# Altium project MaverickPowerDistribution_v1.0.PrjPcb (part 1 of 2)
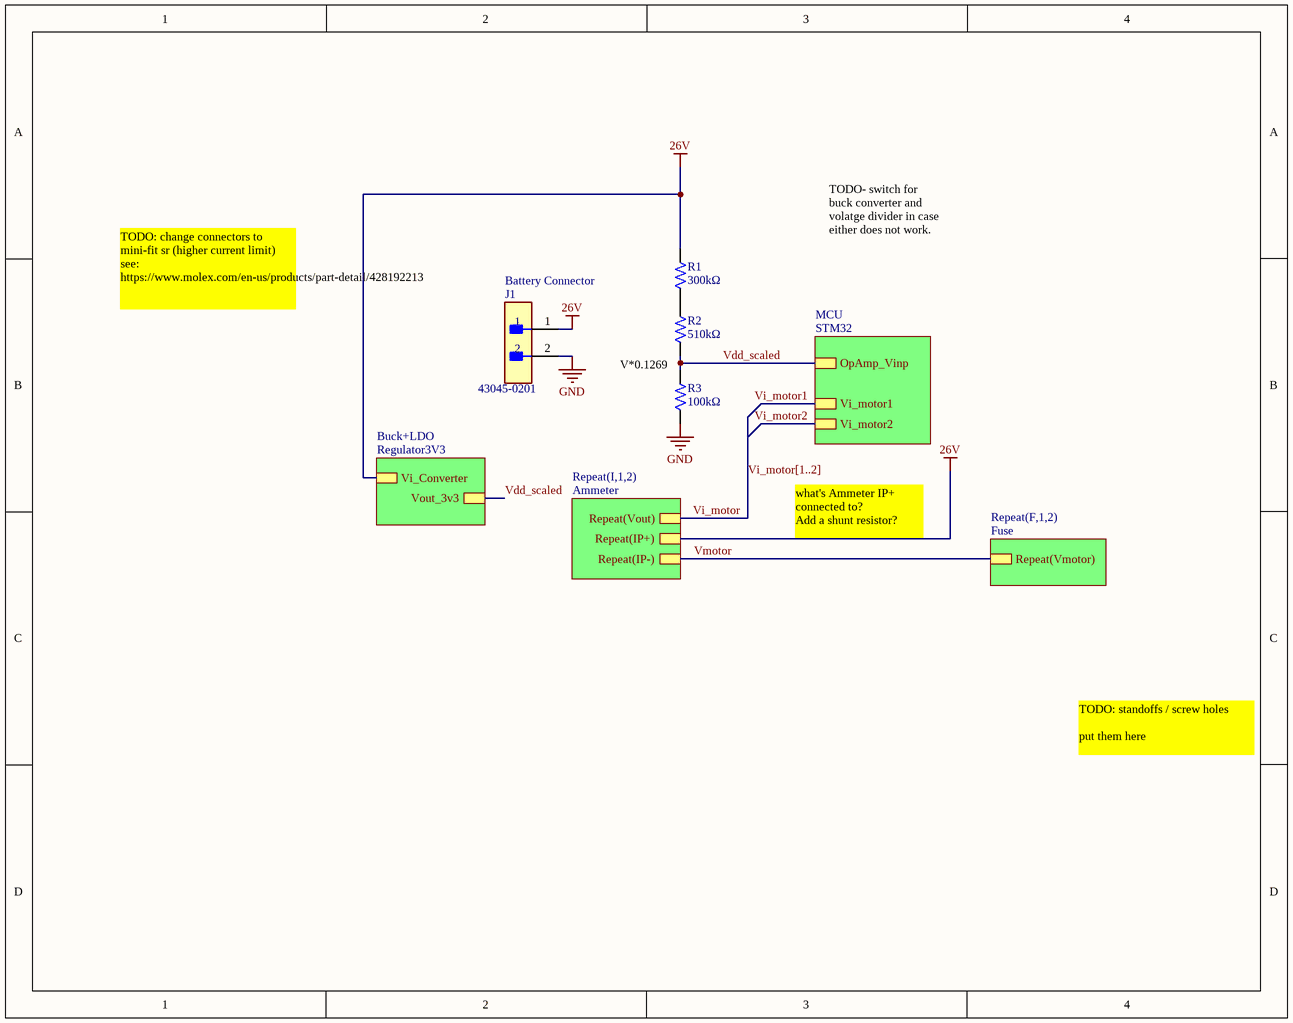
[diagram p0: Power.SchDoc]
8 sheets, 76 parts. Net scope: hierarchical (ports join the sheet entries above them; power ports are global).
Board file: PCB1.PcbDoc
Sheets:
  Power.SchDoc
    I1 = Ammeter.SchDoc
    I2 = Ammeter.SchDoc
    MCU = STM32.SchDoc
      128x64 OLED = Display.SchDoc
      Mass Storage = MicroSD.SchDoc
      Debugger = SWD.SchDoc
    F1 = Fuse.SchDoc
    F2 = Fuse.SchDoc
    Buck+LDO = Regulator3V3.SchDoc

## Sheet Power.SchDoc
size A; SheetNumber: 1; SheetTotal: 8

### Parts
J1  43045-0201  [FP-43045-0201-MFG]
R1  Resistance: 300kΩ  [RES-0603]  (hidden comment: 0603WAF3003T5E)
R2  Resistance: 510kΩ  [RES-0603]  (hidden comment: 0603WAF5103T5E)
R3  Resistance: 100kΩ  [RES-0402]  (hidden comment: 0402WGF1003TCE)

### Sub-sheets
Buck+LDO = Regulator3V3: Vi_Converter, Vout_3v3
MCU = STM32: Vi_motor1, Vi_motor2, OpAmp_Vinp
Repeat(F,1,2) = Fuse: Repeat(Vmotor)
Repeat(I,1,2) = Ammeter: Repeat(Vout), Repeat(IP-), Repeat(IP+)

### Nets
26V: J1.1 R1.2 ; sheet Repeat(I,1,2)/Repeat(IP+), sheet Buck+LDO/Vi_Converter
GND: J1.2 R3.1
Vdd_scaled: R2.1 R3.2 ; sheet MCU/OpAmp_Vinp, sheet Buck+LDO/Vout_3v3  [project net OPAMP1_VINP]
Vi_motor: sheet Repeat(I,1,2)/Repeat(Vout)
Vmotor: sheet Repeat(I,1,2)/Repeat(IP-), sheet Repeat(F,1,2)/Repeat(Vmotor)
NetR1_1: R1.1 R2.2

### Buses and harness runs
bus Vi_motor[1..2]

### Notes on the sheet
- (near J1) Battery Connector
- TODO- switch for buck converter and volatge divider in case either does not work.
- TODO: change connectors to mini-fit sr (higher current limit)
  see: https://www.molex.com/en-us/products/part-detail/428192213
- V*0.1269
- what's Ammeter IP+ connected to?
  Add a shunt resistor?
- TODO: standoffs / screw holes
  put them here

### Library data of the parts
J1 = CMP-04776-000998-1: CONN HEADER R/A 2POS; Number of Circuits: 2; Glow Wire Compliant: Compliant; Pitch: 3mm; Max Voltage Rating (DC): 250.25kV; Current Rating: 5A; Contact Resistance: 10mR; Gender: Male; Voltage Rating: 250V; Number of Positions: 2; Halogen Free: Low Halogen; Series: 43045; Mount: Through Hole; Packaging: Tray; Row Spacing: 3mm; Contact Material: Brass; Radiation Hardening: No; Number of Contacts: 2; Orientation: Right Angle; Max Operating Temperature: 105°C; Housing Material: Thermoplastic; Contact Plating: Gold; Case/Package: 0201; Number of Rows: 2; Min Operating Temperature: -40°C; Termination: Solder; Package Quantity: 3168
R1 = 0603WAF3003T5E: Resistor, 300kΩ, ±1%, 100mW, 75V, ±100ppm/℃, -55℃~+155℃, SMD 0603; Manufacturer: Uniroyal; Supplier 1: LCSC; Manufacturer Part Number: 0603WAF3003T5E; Supplier Part Number 1: C23024; JLCPCB Part Number: C23024; Power Rating: 100mW; Category: Resistors; Package Size: 0603; JLCPCB Basic Part: Yes; Tolerance: ±1%; Voltage Rating: 75V; Temperature Coefficient: ±100ppm/℃; Temperature Rating: -55℃~+155℃; ComponentLink1Description: Datasheet; ComponentLink1URL: https://wmsc.lcsc.com/wmsc/upload/file/pdf/v2/lcsc/2206010116_UNI-ROYAL-Uniroyal-Elec-0603WAF3003T5E_C23024.pdf; ComponentLink2Description: JLCPCB Part URL; ComponentLink2URL: https://jlcpcb.com/partdetail/C23024
R2 = 0603WAF5103T5E: Resistor, 510kΩ, ±1%, 100mW, 75V, ±100ppm/℃, -55℃~+155℃, SMD 0603; Manufacturer: Uniroyal; Supplier 1: LCSC; Manufacturer Part Number: 0603WAF5103T5E; Supplier Part Number 1: C23192; JLCPCB Part Number: C23192; Power Rating: 100mW; Category: Resistors; Package Size: 0603; JLCPCB Basic Part: Yes; Tolerance: ±1%; Voltage Rating: 75V; Temperature Coefficient: ±100ppm/℃; Temperature Rating: -55℃~+155℃; ComponentLink1Description: Datasheet; ComponentLink1URL: https://wmsc.lcsc.com/wmsc/upload/file/pdf/v2/lcsc/2206010116_UNI-ROYAL-Uniroyal-Elec-0603WAF5103T5E_C23192.pdf; ComponentLink2Description: JLCPCB Part URL; ComponentLink2URL: https://jlcpcb.com/partdetail/C23192
R3 = 0402WGF1003TCE: Resistor, 100kΩ, ±1%, 62.5mW, 50V, ±100ppm/℃, -55℃~+155℃, SMD 0402; Manufacturer: Uniroyal; Supplier 1: LCSC; Manufacturer Part Number: 0402WGF1003TCE; Supplier Part Number 1: C25741; JLCPCB Part Number: C25741; Power Rating: 62.5mW; Category: Resistors; Package Size: 0402; JLCPCB Basic Part: Yes; Tolerance: ±1%; Voltage Rating: 50V; Temperature Coefficient: ±100ppm/℃; Temperature Rating: -55℃~+155℃; ComponentLink1Description: Datasheet; ComponentLink1URL: https://wmsc.lcsc.com/wmsc/upload/file/pdf/v2/lcsc/2206010100_UNI-ROYAL-Uniroyal-Elec-0402WGF1003TCE_C25741.pdf; ComponentLink2Description: JLCPCB Part URL; ComponentLink2URL: https://jlcpcb.com/partdetail/C25741

## Sheet Ammeter.SchDoc
size A; SheetNumber: 7; SheetTotal: 8; SPICEModelCacheFFTHAXDY: <root> / <DocumentId>FFTHAXDY</DocumentId> / <CacheFrame Number="0"> / <Model Name="jmk105bj105_v-f" Kind="CKT"> / <Text>* JMK105BJ105_V-F     SPICE MODEL  ( General Type ) / *-------------------------------------------------------------------------------------------------------- / * Model Generated by TAIYO YUDEN Corporation (http://www.ty-top.com) / * Version 1.0 / * TAIYO YUDEN Control No. 170508_130520 / *-------------------------------------------------------------------------------------------------------- / * / * Products Name : Multilayer Ceramic Capacitors / * / * Characteristics : / *     Capacitance : 1 uF , Rated Voltage : 6.3V , TCC : X5R / *     Case Size : 1.0 x 0.5 / 0.039 x 0.02 [mm/inch] , Thickness : 0.5 / 0.02 [mm/inch] / *     (Conditions: Temperature = 25 degC , DC Bias Current/Voltage = 0A / 0V) / * / * Frequency Range : 40Hz - 3GHz / * / * External Node Assignments : / * / *  1  o---| |---o  2 / * / *-------------------------------------------------------------------------------------------------------- / .SubCkt JMK105BJ105_V-F 1 2 / **************************** / C0 1 110 0.63639u / Cm 1 101 0.20521u / C1 101 102 0.32947u / Rc1 101 102 4.3866k / C2 102 103 0.095518u / Rc2 102 103 147.03 / C3 103 110 0.027492u / Rc3 103 110 13.702 / C2m 1 301 0.26441u / C21 301 302 1.8886u / Rc21 301 302 5.8853k / C22 302 303 1.591u / Rc22 302 303 6.0107k / C23 303 304 1.1128u / Rc23 303 304 7.9202k / C24 304 305 0.6027u / Rc24 304 305 330.52 / C25 305 306 0.40375u / Rc25 305 306 352.84 / C26 306 307 0.52396u / Rc26 306 307 8.4799 / C27 307 308 0.86606u / Rc27 307 308 4.7644 / C28 308 309 0.52694u / Rc28 308 309 7.6737 / C29 309 110 1095.2p / Rc29 309 110 0.46166 / Rp0 1 110 100Meg / L0 110 120 0.22207n / Lm 120 130 0.1526n / L1 120 121 0.021807n / RL1 121 130 0.95652 / L2 120 122 0.17379n / RL2 122 130 0.69676 / L3 120 123 0.80256n / RL3 123 130 0.1611 / CR 120 124 0.086847u / LR 124 125 0.095213n / RR 125 130 0.14597 / CL 130 140 2.0214p / LL 130 140 0.14724n / RL 130 140 1.7247k / Rs 140 2 11.702m / **************************** / .ends</Text> / </Model> / </CacheFrame> / </root>
Used 2 times, as channels I1, I2. Parts and nets are listed once, with the designators drawn on the sheet.
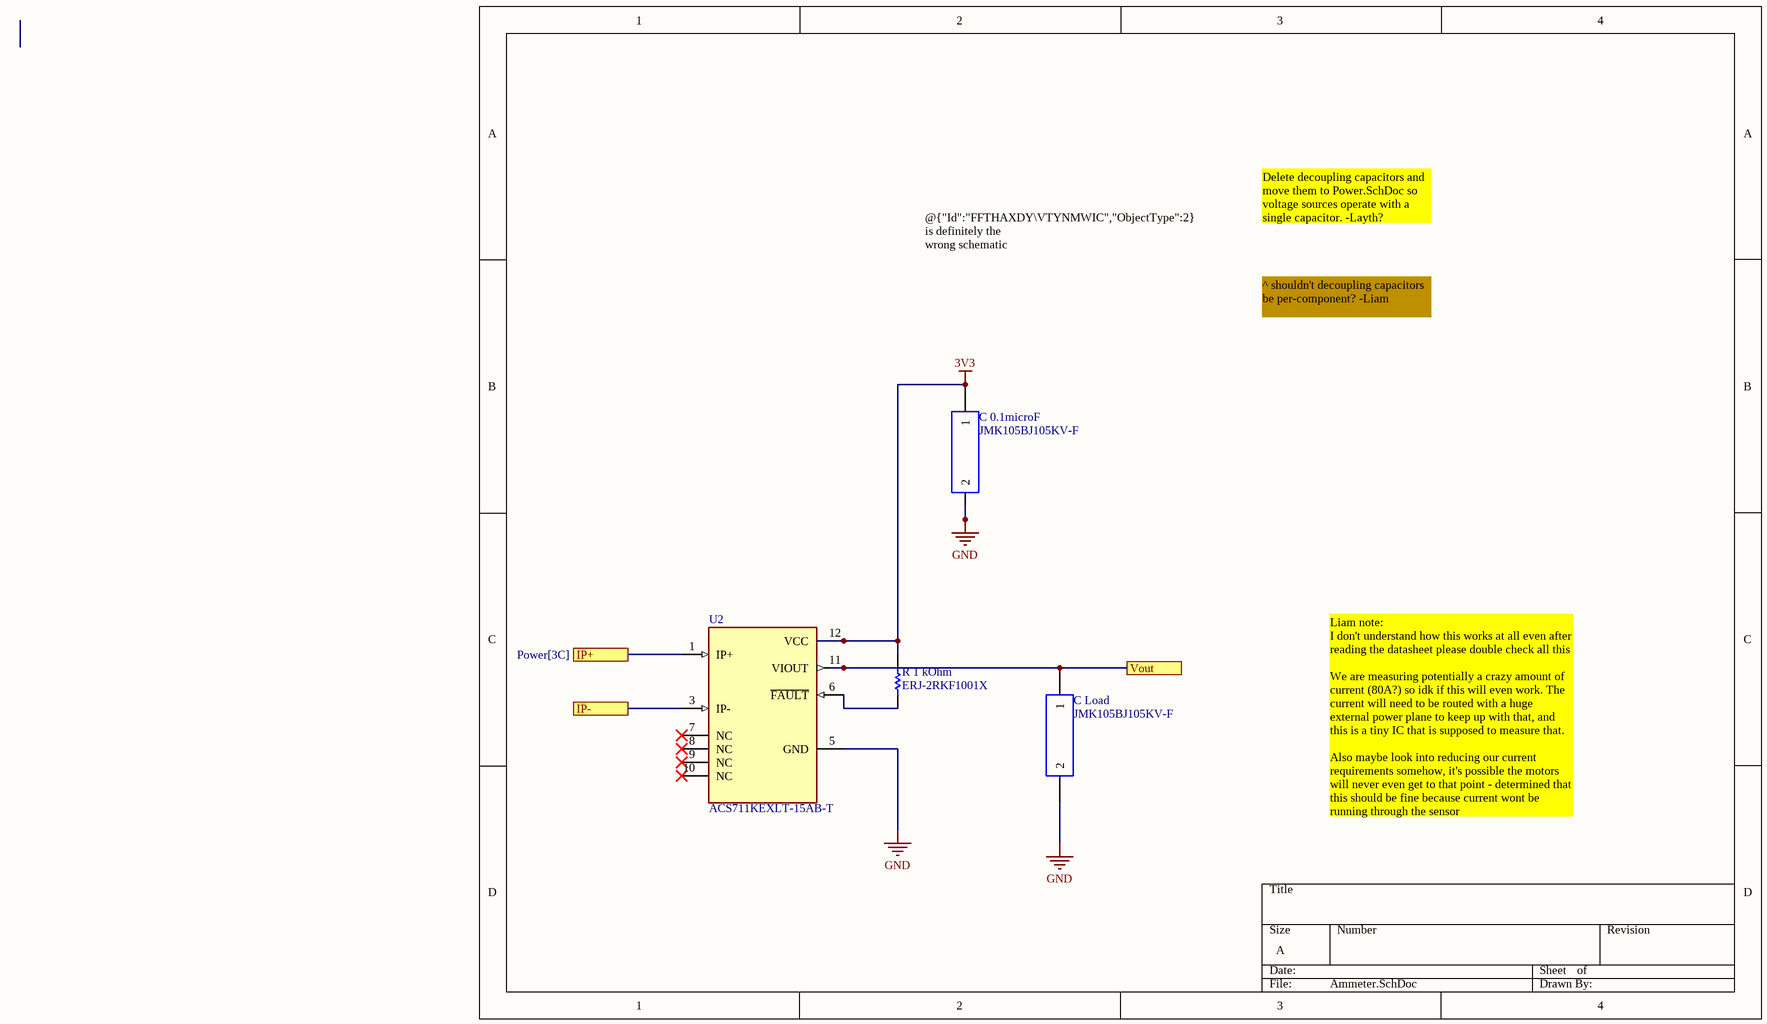
[diagram p1: Ammeter.SchDoc]

### Parts
C_0.1microF  JMK105BJ105KV-F
C_Load  JMK105BJ105KV-F
R_1_kOhm  ERJ-2RKF1001X  [RESC1005X40X25NL05T05]
U2  ACS711KEXLT-15AB-T  [XDCR_ACS711KEXLT-15AB-T]

### Ports
IP+ (see Power[3C]), IP- (see Power[3C]), Vout (see Power[3C])

### Nets
3V3: C_0.1microF.1 R_1_kOhm.2 U2.12(VCC)
GND: C_0.1microF.2 C_Load.2 U2.5(GND)
IP+: U2.1(IP+) ; port IP+
IP-: U2.3(IP-) ; port IP-
Vout: C_Load.1 U2.11(VIOUT) ; port Vout
NetR_1_kOhm_1: R_1_kOhm.1 U2.6(~{FAULT})

Not connected (* = marked no-connect by the designer): U2 7(NC)* 8(NC)* 9(NC)* 10(NC)*

### Channels
I1: designators C 0.1microF=C_0.1microFA C Load=C_LoadA R 1 kOhm=R_1_kOhmA U2=U2A; ports IP+=NetU2A_1 IP-=Vmotor1 Vout=ADC1_IN9
I2: designators C 0.1microF=C_0.1microFB C Load=C_LoadB R 1 kOhm=R_1_kOhmB U2=U2B; ports IP+=NetU2B_1 IP-=Vmotor2 Vout=ADC1_IN10

### Notes on the sheet
- Delete decoupling capacitors and move them to Power.SchDoc so voltage sources operate with a single capacitor. -Layth?
- @{"Id":"FFTHAXDY\VTYNMWIC","ObjectType":2} is definitely the wrong schematic
- ^ shouldn't decoupling capacitors be per-component? -Liam
- Liam note:
  I don't understand how this works at all even after reading the datasheet please double check all this
  We are measuring potentially a crazy amount of current (80A?) so idk if this will even work. The current will need to be routed with a huge external power plane to keep up with that, and this is a tiny IC that is supposed to measure that.
  Also maybe look into reducing our current requirements somehow, it's possible the motors will never even get to that point - determined that this should be fine because current wont be running through the sensor

### Library data of the parts
C_0.1microF C_Load = CMP-14477-004050-1: None; Voltage Rating: 6.3V; Dielectric: X5R; Capacitance: 1uF; Tolerance: 10%; Min Operating Temperature: -55°C; Construction: Flat; RoHS Compliant: Yes; Case Code (Imperial): 0402; Mount: Surface Mount; Number of Pins: 2; Termination: SMD/SMT; Series: M; Thickness: 0.022inch; Case Code (Metric): 1005; Packaging: Tape and Reel; Length: 1mm; Resistor Type: Ceramic; Package Quantity: 1; Max Operating Temperature: 85°C; Voltage Rating (DC): 6.3V; Case/Package: 0402; Width: 0.02inch; Lead Free: Lead Free; Radiation Hardening: No; Depth: 0.5mm; Halogen Free: Halogen Free; Height: 0.5mm; REACH SVHC: No SVHC
R_1_kOhm = CMP-1011-00510-4: Chip Resistor, 1 KOhm, +/- 1%, 100 mW, -55 to 155 degC, 0402 (1005 Metric), RoHS, Tape and Reel; Manufacturer: Basic Passives; Voltage Rating: 50 V; Case\/Package: 0402; Resistance: 1 KOhm; Power Rating: 100 mW; PartNumber: ERJ-2RKF1001X; DatasheetVersion: 04/2015; Radiation Hardening: No; Pins: 2; Height: 0.35 mm; RoHSCompliant: true; Case Code (Imperial): 0402; ComponentLink2Description: Datasheet; ComponentLink1Description: Manufacturer URL; PackageReference: 0402; Mount: Surface Mount; Package Quantity: 10000; Tolerance: 1%; ComponentLink1URL: http://www.panasonic.com/; PackageDescription: 2-Pin Surface Mount Device, Body 1 x 0.5 mm; Mounting Technology: Surface Mount; Case Code (Metric): 1005; ComponentLink2URL: http://industrial.panasonic.com/cdbs/www-data/pdf/RDA0000/AOA0000C86.pdf; REACH SVHC: Yes; Packaging: Tape and Reel; Max Operating Temperature: 155 degC; Min Operating Temperature: -55 degC; Width: 0.5 mm; Length: 1 mm
U2 = ACS711KEXLT-15AB-T: Current Sensor 31A 1 Channel Hall Effect, Open Loop Bidirectional 12-PowerWFQFN; MF: Allegro MicroSystems LLC; MP: ACS711KEXLT-31AB-T; Purchase-URL: https://pricing.snapeda.com/search/part/ACS711KEXLT-31AB-T/?ref=eda; Package: QFN-12 Allegro MicroSystems LLC; Value: *; Availability: In Stock; Price: None; SnapEDA_Link: https://www.snapeda.com/parts/ACS711KEXLT-31AB-T/Allegro+MicroSystems+LLC/view-part/?ref=snap; Check_prices: https://www.snapeda.com/parts/ACS711KEXLT-31AB-T/Allegro+MicroSystems+LLC/view-part/?ref=eda

## Sheet STM32.SchDoc
size A; SheetNumber: 3; SheetTotal: 8
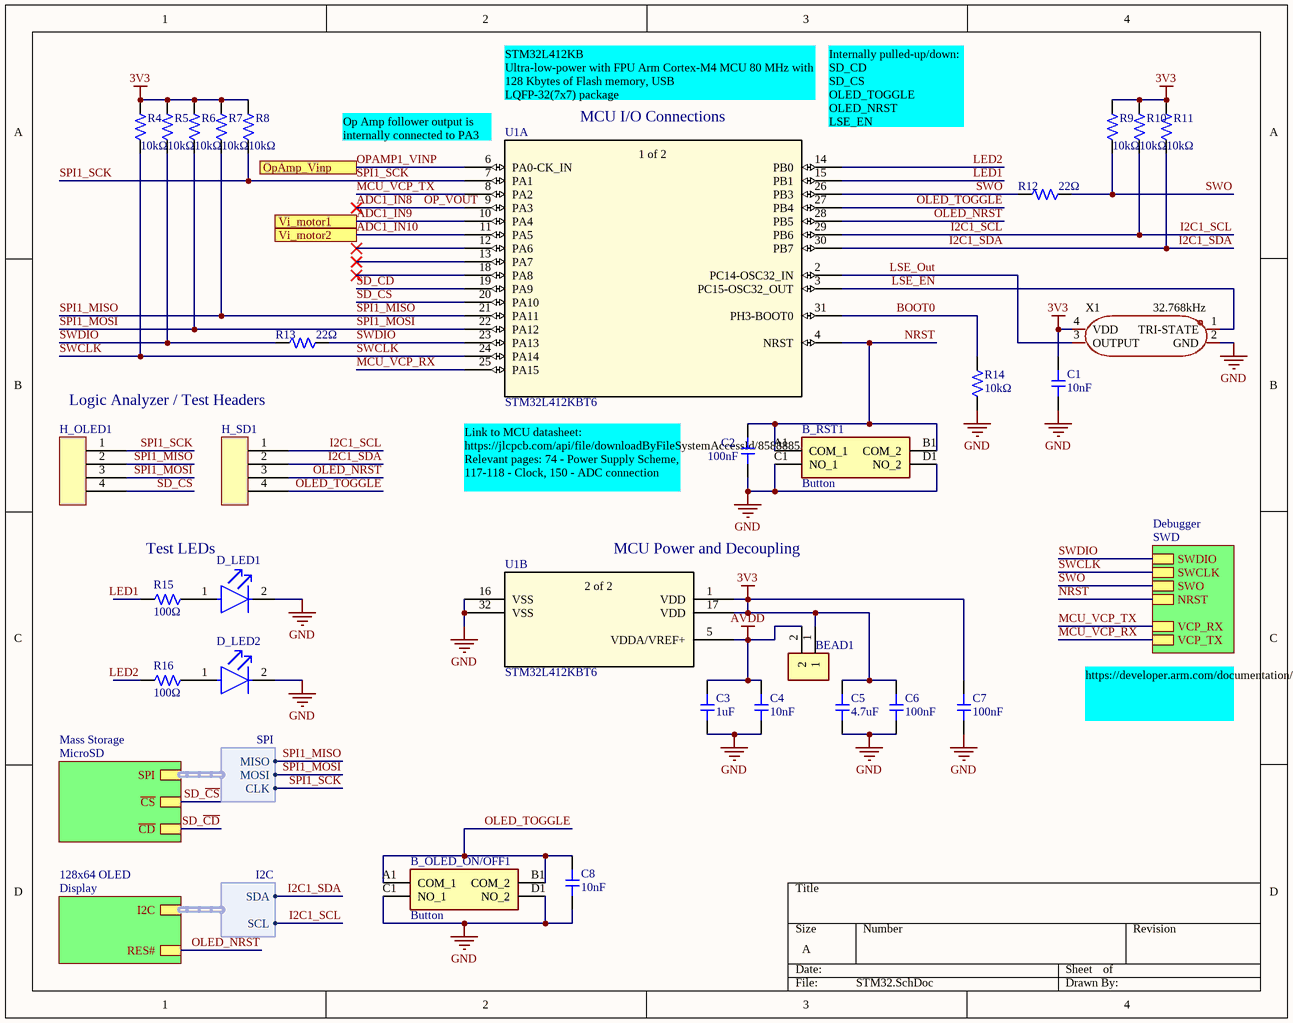
[diagram p2: STM32.SchDoc]

### Parts
B_OLED_ON/OFF1  Button  [TS1187ABAB]
B_RST1  Button  [TS1187ABAB]
BEAD1  GZ1608D601TF  [BEADC1608X95N]  (value not drawn)
C1  Capacitance: 10nF  [CAP-0402]  (hidden comment: CL05B103KB5NNNC)
C2  Capacitance: 100nF  [CAP-0402]  (hidden comment: CL05B104KB54PNC)
C3  Capacitance: 1uF  [CAP-0402]  (hidden comment: CL05A105KA5NQNC)
C4  Capacitance: 10nF  [CAP-0402]  (hidden comment: CL05B103KB5NNNC)
C5  Capacitance: 4.7uF  [CAP-0402]  (hidden comment: CL05A475MP5NRNC)
C6  Capacitance: 100nF  [CAP-0402]  (hidden comment: CL05B104KO5NNNC)
C7  Capacitance: 100nF  [CAP-0402]  (hidden comment: CL05B104KO5NNNC)
C8  Capacitance: 10nF  [CAP-0402]  (hidden comment: CL05B103KB5NNNC)
D_LED1  (no value)  [FP-AP2012EC-MFG]
D_LED2  (no value)  [FP-AP2012EC-MFG]
H_OLED1  4-pin Header  [4-pin Header]  (value not drawn)
H_SD1  4-pin Header  [4-pin Header]  (value not drawn)
R4  Resistance: 10kΩ  [RES-0402]  (hidden comment: 0402WGF1002TCE)
R5  Resistance: 10kΩ  [RES-0402]  (hidden comment: 0402WGF1002TCE)
R6  Resistance: 10kΩ  [RES-0402]  (hidden comment: 0402WGF1002TCE)
R7  Resistance: 10kΩ  [RES-0402]  (hidden comment: 0402WGF1002TCE)
R8  Resistance: 10kΩ  [RES-0402]  (hidden comment: 0402WGF1002TCE)
R9  Resistance: 10kΩ  [RES-0402]  (hidden comment: 0402WGF1002TCE)
R10  Resistance: 10kΩ  [RES-0402]  (hidden comment: 0402WGF1002TCE)
R11  Resistance: 10kΩ  [RES-0402]  (hidden comment: 0402WGF1002TCE)
R12  Resistance: 22Ω  [RES-0402]  (hidden comment: 0402WGF220JTCE)
R13  Resistance: 22Ω  [RES-0402]  (hidden comment: 0402WGF220JTCE)
R14  Resistance: 10kΩ  [RES-0402]  (hidden comment: 0402WGF1002TCE)
R15  Resistance: 100Ω  [RES-0402]  (hidden comment: 0402WGF1000TCE)
R16  Resistance: 100Ω  [RES-0402]  (hidden comment: 0402WGF1000TCE)
U1  STM32L412KBT6  [LQFP-32]  (parts A,B of 2)
X1  32.768kHz  [OSC-SMD_4P-L3.2-W2.5-BL]

### Sub-sheets
128x64 OLED = Display: I2C (harness I2C), RES#
Debugger = SWD: SWDIO, SWCLK, SWO, NRST, VCP_TX, VCP_RX
Mass Storage = MicroSD: SPI (harness SPI), ~{CS}, ~{CD}

### Ports
OpAmp_Vinp (see Power[3B]), Vi_motor1 (see Power[3B]), Vi_motor2 (see Power[3B])

### Harnesses
SPI: MISO, MOSI, CLK
I2C: SDA, SCL

### Nets
3V3: BEAD1.1 C1.2 C5.2 C6.2 C7.2 R4.2 R5.2 R6.2 R7.2 R8.2 R9.2 R10.2 R11.2 U1.1(VDD) U1.17(VDD) X1.4(VDD)
AVDD: BEAD1.2 C3.2 C4.2 U1.5(VDDA/VREF+)
GND: B_OLED_ON/OFF1.C1(NO_1) B_OLED_ON/OFF1.D1(NO_2) B_RST1.C1(NO_1) B_RST1.D1(NO_2) C1.1 C2.1 C3.1 C4.1 C5.1 C6.1 C7.1 C8.1 D_LED1.2(C) D_LED2.2(C) R14.1 U1.16(VSS) U1.32(VSS) X1.2(GND)
ADC1_IN8: U1.9(PA3)  [also labelled OP_VOUT]
ADC1_IN9: U1.10(PA4) ; port Vi_motor1
ADC1_IN10: U1.11(PA5) ; port Vi_motor2
BOOT0: R14.2 U1.31(PH3-BOOT0)
I2C1_SCL: H_SD1.1 R10.1 U1.29(PB6) ; sheet 128x64 OLED/I2C.SCL  [project net I2C.SCL]
I2C1_SDA: H_SD1.2 R11.1 U1.30(PB7) ; sheet 128x64 OLED/I2C.SDA  [project net I2C.SDA]
LED1: R15.1 U1.15(PB1)
LED2: R16.1 U1.14(PB0)
LSE_EN: U1.3(PC15-OSC32_OUT) X1.1(TRI-STATE)
LSE_Out: U1.2(PC14-OSC32_IN) X1.3(OUTPUT)
MCU_VCP_RX: U1.25(PA15) ; sheet Debugger/VCP_TX
MCU_VCP_TX: U1.8(PA2) ; sheet Debugger/VCP_RX
NRST: B_RST1.A1(COM_1) B_RST1.B1(COM_2) C2.2 U1.4(NRST) ; sheet Debugger/NRST
OLED_NRST: H_SD1.3 U1.28(PB5) ; sheet 128x64 OLED/RES#
OLED_TOGGLE: B_OLED_ON/OFF1.A1(COM_1) B_OLED_ON/OFF1.B1(COM_2) C8.2 H_SD1.4 U1.27(PB4)
OPAMP1_VINP: U1.6(PA0-CK_IN) ; port OpAmp_Vinp
SD_~{CD}: U1.19(PA9) ; sheet Mass Storage/~{CD}  [project net CardDetect]
SD_~{CS}: H_OLED1.4 U1.20(PA10) ; sheet Mass Storage/~{CS}  [project net ~{CS}]
SPI1_MISO: H_OLED1.2 R7.1 U1.21(PA11) ; sheet Mass Storage/SPI.MISO  [project net SPI.MISO]
SPI1_MOSI: H_OLED1.3 R6.1 U1.22(PA12) ; sheet Mass Storage/SPI.MOSI  [project net SPI.MOSI]
SPI1_SCK: H_OLED1.1 R8.1 U1.7(PA1) ; sheet Mass Storage/SPI.CLK  [project net SPI.CLK]
SWCLK: R4.1 U1.24(PA14) ; sheet Debugger/SWCLK
SWDIO: R5.1 R13.1 R13.2 U1.23(PA13) ; sheet Debugger/SWDIO
SWO: R9.1 R12.1 R12.2 U1.26(PB3) ; sheet Debugger/SWO
NetD_LED1_1: D_LED1.1(A) R15.2
NetD_LED2_1: D_LED2.1(A) R16.2

Not connected (* = marked no-connect by the designer): U1 12(PA6)* 13(PA7)* 18(PA8)*

### Notes on the sheet
- STM32L412KB
  Ultra-low-power with FPU Arm Cortex-M4 MCU 80 MHz with 128 Kbytes of Flash memory, USB
  LQFP-32(7x7) package
- (near U1) Op Amp follower output is internally connected to PA3
- (near U1) MCU I/O Connections
- (near U1) Internally pulled-up/down:
  SD_CD
  SD_CS
  OLED_TOGGLE
  OLED_NRST
  LSE_EN
- Logic Analyzer / Test Headers
- Link to MCU datasheet: https://jlcpcb.com/api/file/downloadByFileSystemAccessId/8588885545674424320
  Relevant pages: 74 - Power Supply Scheme, 117-118 - Clock, 150 - ADC connection
- Test LEDs
- (near U1) MCU Power and Decoupling
- https://developer.arm.com/documentation/dui0499/a/Target-Interface-Connections/SWD-connections
- (in symbol STM32L412KBT6, part A) 1 of 2
- (in symbol STM32L412KBT6, part B) 2 of 2

### Library data of the parts
B_OLED_ON/OFF1 B_RST1 = TS-1187A-B-A-B: Manufacturer_Name: XKB Connectivity; Datasheet Link: http://www.helloxkb.com/public/images/pdf/TS-1187A-X-X-X.pdf; Height: 4.05mm; Manufacturer_Part_Number: TS-1187A-B-A-B
BEAD1 = GZ1608D601TF: Ferrite Bead; Manufacturer_Name: SUNLORD; Datasheet Link: https://datasheet.lcsc.com/szlcsc/Sunlord-GZ1608D601TF_C1002.pdf; Height: 0.95mm; Manufacturer_Part_Number: GZ1608D601TF
C1 C4 C8 = CL05B103KB5NNNC: Capacitor, Ceramic (MLCC), 10nF, ±10%, 50V, X7R, ±10%, SMD 0402; Manufacturer: Samsung Electro-Mechanics; Temperature Rating: -55°C ~ 125°C; Capacitance @ 1V DC Bias: 10.426nF; Capacitance @ 1.2V DC Bias: 10.434nF; Capacitance @ 1.35V DC Bias: 10.444nF; Capacitance @ 1.5V DC Bias: 10.455nF; Capacitance @ 1.8V DC Bias: 10.480nF; Capacitance @ 2.5V DC Bias: 10.514nF; Capacitance @ 3.3V DC Bias: 10.519nF; Capacitance @ 3.7V DC Bias: 10.504nF; Capacitance @ 4.2V DC Bias: 10.473nF; Capacitance @ 5V DC Bias: 10.402nF; Capacitance @ 9V DC Bias: 10.052nF; Capacitance @ 12V DC Bias: 9.639nF; Capacitance @ 15V DC Bias: 9.187nF; Capacitance @ 24V DC Bias: 7.606nF; Capacitance @ 36V DC Bias: 5.499nF; Capacitance @ 48V DC Bias: 3.591nF; Impedance (0V Bias) @ 100Hz: 1.57E+05Ω; Impedance (0V Bias) @ 500Hz: 3.19E+04Ω; Impedance (0V Bias) @ 1kHz: 1.61E+04Ω; Impedance (0V Bias) @ 5kHz: 3.27E+03Ω; Impedance (0V Bias) @ 10kHz: 1.65E+03Ω; Impedance (0V Bias) @ 50kHz: 335Ω; Impedance (0V Bias) @ 100kHz: 169Ω; Impedance (0V Bias) @ 500kHz: 34.3Ω; Impedance (0V Bias) @ 1MHz: 17.3Ω; Impedance (0V Bias) @ 5MHz: 3.52Ω; Impedance (0V Bias) @ 10MHz: 1.77Ω; Impedance (0V Bias) @ 50MHz: 0.285Ω; Impedance (0V Bias) @ 100MHz: 0.0835Ω; Impedance (0V Bias) @ 500MHz: 0.751Ω; Impedance (0V Bias) @ 1GHz: 1.42Ω; Impedance (0V Bias) @ 2GHz: 3.22Ω; Impedance (0V Bias) @ 5GHz: 6.48Ω; Package Size: 0402; JLCPCB Basic Part: Yes; JLCPCB Part Number: C15195; Supplier 1: LCSC; Category: Capacitors - MLCC; Supplier Part Number 1: C15195; Manufacturer Part Number: CL05B103KB5NNNC; Tolerance: ±10%; Voltage Rating: 50V; Temperature Coefficient: X7R; RoHS: Yes; ComponentLink1Description: Datasheet; ComponentLink1URL: https://wmsc.lcsc.com/wmsc/upload/file/pdf/v2/lcsc/2304140030_Samsung-Electro-Mechanics-CL05B103KB5NNNC_C15195.pdf; ComponentLink2Description: JLCPCB Part URL; ComponentLink2URL: https://jlcpcb.com/partdetail/C15195; ComponentLink3Description: LCSC Part URL; ComponentLink3URL: https://lcsc.com/product-detail/Multilayer-Ceramic-Capacitors-MLCC---SMD-SMT_Samsung-Electro-Mechanics-Samsung-Electro-Mechanics-CL05B103KB5NNNC_C15195.html; ComponentLink4Description: Samsung Component Library; ComponentLink4URL: https://weblib.samsungsem.com/mlcc/mlcc-ec.do?partNumber=CL05B103KB5NNN
C2 = CL05B104KB54PNC: Capacitor, Ceramic (MLCC), 100nF, ±10%, 50V, X7R, ±10%, SMD 0402; Manufacturer: Samsung Electro-Mechanics; Temperature Rating: -55°C ~ 125°C; Capacitance @ 1V DC Bias: 105.687nF; Capacitance @ 1.2V DC Bias: 105.639nF; Capacitance @ 1.35V DC Bias: 105.594nF; Capacitance @ 1.5V DC Bias: 105.528nF; Capacitance @ 1.8V DC Bias: 105.317nF; Capacitance @ 2.5V DC Bias: 104.216nF; Capacitance @ 3.3V DC Bias: 102.385nF; Capacitance @ 3.7V DC Bias: 101.236nF; Capacitance @ 4.2V DC Bias: 99.650nF; Capacitance @ 5V DC Bias: 96.918nF; Capacitance @ 9V DC Bias: 81.073nF; Capacitance @ 12V DC Bias: 69.786nF; Capacitance @ 15V DC Bias: 59.475nF; Capacitance @ 24V DC Bias: 38.112nF; Capacitance @ 36V DC Bias: 23.027nF; Capacitance @ 48V DC Bias: 16.035nF; Impedance (0V Bias) @ 100Hz: 1.66E+04Ω; Impedance (0V Bias) @ 500Hz: 3.38E+03Ω; Impedance (0V Bias) @ 1kHz: 1.7E+03Ω; Impedance (0V Bias) @ 5kHz: 346Ω; Impedance (0V Bias) @ 10kHz: 175Ω; Impedance (0V Bias) @ 50kHz: 35.5Ω; Impedance (0V Bias) @ 100kHz: 17.9Ω; Impedance (0V Bias) @ 500kHz: 3.64Ω; Impedance (0V Bias) @ 1MHz: 1.84Ω; Impedance (0V Bias) @ 5MHz: 0.366Ω; Impedance (0V Bias) @ 10MHz: 0.172Ω; Impedance (0V Bias) @ 50MHz: 0.0626Ω; Impedance (0V Bias) @ 100MHz: 0.128Ω; Impedance (0V Bias) @ 500MHz: 0.487Ω; Impedance (0V Bias) @ 1GHz: 0.87Ω; Impedance (0V Bias) @ 2GHz: 2Ω; Impedance (0V Bias) @ 5GHz: 3.96Ω; Package Size: 0402; JLCPCB Basic Part: Yes; JLCPCB Part Number: C307331; Supplier 1: LCSC; Category: Capacitors - MLCC; Supplier Part Number 1: C307331; Manufacturer Part Number: CL05B104KB54PNC; Tolerance: ±10%; Voltage Rating: 50V; Temperature Coefficient: X7R; RoHS: Yes; ComponentLink1Description: Datasheet; ComponentLink1URL: https://wmsc.lcsc.com/wmsc/upload/file/pdf/v2/lcsc/2304140030_Samsung-Electro-Mechanics-CL05B104KB54PNC_C307331.pdf; ComponentLink2Description: JLCPCB Part URL; ComponentLink2URL: https://jlcpcb.com/partdetail/C307331; ComponentLink3Description: LCSC Part URL; ComponentLink3URL: https://lcsc.com/product-detail/Multilayer-Ceramic-Capacitors-MLCC---SMD-SMT_Samsung-Electro-Mechanics-Samsung-Electro-Mechanics-CL05B104KB54PNC_C307331.html; ComponentLink4Description: Samsung Component Library; ComponentLink4URL: https://weblib.samsungsem.com/mlcc/mlcc-ec.do?partNumber=CL05B104KB54PN
C3 = CL05A105KA5NQNC: Capacitor, Ceramic (MLCC), 1uF, ±10%, 25V, X5R, ±10%, SMD 0402; Manufacturer: Samsung Electro-Mechanics; Temperature Rating: -55°C ~ 85°C; Capacitance @ 1V DC Bias: 1.014uF; Capacitance @ 1.2V DC Bias: 0.983uF; Capacitance @ 1.35V DC Bias: 0.958uF; Capacitance @ 1.5V DC Bias: 0.932uF; Capacitance @ 1.8V DC Bias: 0.879uF; Capacitance @ 2.5V DC Bias: 0.755uF; Capacitance @ 3.3V DC Bias: 0.618uF; Capacitance @ 3.7V DC Bias: 0.562uF; Capacitance @ 4.2V DC Bias: 0.501uF; Capacitance @ 5V DC Bias: 0.420uF; Capacitance @ 9V DC Bias: 0.204uF; Capacitance @ 12V DC Bias: 0.147uF; Capacitance @ 15V DC Bias: 0.107uF; Capacitance @ 24V DC Bias: 0.061uF; Impedance (0V Bias) @ 100Hz: 1.95E+03Ω; Impedance (0V Bias) @ 500Hz: 402Ω; Impedance (0V Bias) @ 1kHz: 204Ω; Impedance (0V Bias) @ 5kHz: 42Ω; Impedance (0V Bias) @ 10kHz: 21.3Ω; Impedance (0V Bias) @ 50kHz: 4.4Ω; Impedance (0V Bias) @ 100kHz: 2.23Ω; Impedance (0V Bias) @ 500kHz: 0.462Ω; Impedance (0V Bias) @ 1MHz: 0.234Ω; Impedance (0V Bias) @ 5MHz: 0.0392Ω; Impedance (0V Bias) @ 10MHz: 0.0118Ω; Impedance (0V Bias) @ 50MHz: 0.0671Ω; Impedance (0V Bias) @ 100MHz: 0.118Ω; Impedance (0V Bias) @ 500MHz: 0.452Ω; Impedance (0V Bias) @ 1GHz: 0.812Ω; Impedance (0V Bias) @ 2GHz: 1.8Ω; Impedance (0V Bias) @ 5GHz: 3.57Ω; Impedance (25V Bias) @ 100Hz: 2.62E+04Ω; Impedance (25V Bias) @ 500Hz: 5.28E+03Ω; Impedance (25V Bias) @ 1kHz: 2.65E+03Ω; Impedance (25V Bias) @ 5kHz: 533Ω; Impedance (25V Bias) @ 10kHz: 267Ω; Impedance (25V Bias) @ 50kHz: 53.8Ω; Impedance (25V Bias) @ 100kHz: 27Ω; Impedance (25V Bias) @ 500kHz: 5.42Ω; Impedance (25V Bias) @ 1MHz: 2.7Ω; Impedance (25V Bias) @ 5MHz: 0.621Ω; Impedance (25V Bias) @ 10MHz: 0.298Ω; Impedance (25V Bias) @ 50MHz: 0.0523Ω; Impedance (25V Bias) @ 100MHz: 0.113Ω; Impedance (25V Bias) @ 500MHz: 0.451Ω; Impedance (25V Bias) @ 1GHz: 0.82Ω; Impedance (25V Bias) @ 2GHz: 1.85Ω; Impedance (25V Bias) @ 5GHz: 3.51Ω; Package Size: 0402; JLCPCB Basic Part: Yes; JLCPCB Part Number: C52923; Supplier 1: LCSC; Category: Capacitors - MLCC; Supplier Part Number 1: C52923; Manufacturer Part Number: CL05A105KA5NQNC; Tolerance: ±10%; Voltage Rating: 25V; Temperature Coefficient: X5R; RoHS: Yes; ComponentLink1Description: Datasheet; ComponentLink1URL: https://wmsc.lcsc.com/wmsc/upload/file/pdf/v2/lcsc/2304140030_Samsung-Electro-Mechanics-CL05A105KA5NQNC_C52923.pdf; ComponentLink2Description: JLCPCB Part URL; ComponentLink2URL: https://jlcpcb.com/partdetail/C52923; ComponentLink3Description: LCSC Part URL; ComponentLink3URL: https://lcsc.com/product-detail/Multilayer-Ceramic-Capacitors-MLCC---SMD-SMT_Samsung-Electro-Mechanics-Samsung-Electro-Mechanics-CL05A105KA5NQNC_C52923.html; ComponentLink4Description: Samsung Component Library; ComponentLink4URL: https://weblib.samsungsem.com/mlcc/mlcc-ec.do?partNumber=CL05A105KA5NQN
C5 = CL05A475MP5NRNC: Capacitor, Ceramic (MLCC), 4.7uF, ±20%, 10V, X5R, ±20%, SMD 0402; Manufacturer: Samsung Electro-Mechanics; Temperature Rating: -55°C ~ 85°C; Capacitance @ 1V DC Bias: 4.048uF; Capacitance @ 1.2V DC Bias: 3.816uF; Capacitance @ 1.35V DC Bias: 3.633uF; Capacitance @ 1.5V DC Bias: 3.450uF; Capacitance @ 1.8V DC Bias: 3.100uF; Capacitance @ 2.5V DC Bias: 2.453uF; Capacitance @ 3.3V DC Bias: 1.872uF; Capacitance @ 3.7V DC Bias: 1.663uF; Capacitance @ 4.2V DC Bias: 1.455uF; Capacitance @ 5V DC Bias: 1.191uF; Capacitance @ 9V DC Bias: 0.548uF; Impedance (0V Bias) @ 100Hz: 442Ω; Impedance (0V Bias) @ 500Hz: 90.2Ω; Impedance (0V Bias) @ 1kHz: 45.6Ω; Impedance (0V Bias) @ 5kHz: 9.34Ω; Impedance (0V Bias) @ 10kHz: 4.72Ω; Impedance (0V Bias) @ 50kHz: 0.964Ω; Impedance (0V Bias) @ 100kHz: 0.486Ω; Impedance (0V Bias) @ 500kHz: 0.0987Ω; Impedance (0V Bias) @ 1MHz: 0.0479Ω; Impedance (0V Bias) @ 5MHz: 0.00709Ω; Impedance (0V Bias) @ 10MHz: 0.0183Ω; Impedance (0V Bias) @ 50MHz: 0.06Ω; Impedance (0V Bias) @ 100MHz: 0.102Ω; Impedance (0V Bias) @ 500MHz: 0.377Ω; Impedance (0V Bias) @ 1GHz: 0.66Ω; Impedance (0V Bias) @ 2GHz: 1.52Ω; Impedance (0V Bias) @ 5GHz: 3.05Ω; Impedance (10V Bias) @ 100Hz: 3.34E+03Ω; Impedance (10V Bias) @ 500Hz: 674Ω; Impedance (10V Bias) @ 1kHz: 338Ω; Impedance (10V Bias) @ 5kHz: 68.2Ω; Impedance (10V Bias) @ 10kHz: 34.2Ω; Impedance (10V Bias) @ 50kHz: 6.88Ω; Impedance (10V Bias) @ 100kHz: 3.45Ω; Impedance (10V Bias) @ 500kHz: 0.693Ω; Impedance (10V Bias) @ 1MHz: 0.344Ω; Impedance (10V Bias) @ 5MHz: 0.0603Ω; Impedance (10V Bias) @ 10MHz: 0.0164Ω; Impedance (10V Bias) @ 50MHz: 0.064Ω; Impedance (10V Bias) @ 100MHz: 0.105Ω; Impedance (10V Bias) @ 500MHz: 0.385Ω; Impedance (10V Bias) @ 1GHz: 0.673Ω; Impedance (10V Bias) @ 5GHz: 3.06Ω; Package Size: 0402; JLCPCB Basic Part: Yes; JLCPCB Part Number: C23733; Supplier 1: LCSC; Category: Capacitors - MLCC; Supplier Part Number 1: C23733; Manufacturer Part Number: CL05A475MP5NRNC; Tolerance: ±20%; Voltage Rating: 10V; Temperature Coefficient: X5R; RoHS: Yes; ComponentLink1Description: Datasheet; ComponentLink1URL: https://wmsc.lcsc.com/wmsc/upload/file/pdf/v2/lcsc/2304140030_Samsung-Electro-Mechanics-CL05A475MP5NRNC_C23733.pdf; ComponentLink2Description: JLCPCB Part URL; ComponentLink2URL: https://jlcpcb.com/partdetail/C23733; ComponentLink3Description: LCSC Part URL; ComponentLink3URL: https://lcsc.com/product-detail/Multilayer-Ceramic-Capacitors-MLCC---SMD-SMT_Samsung-Electro-Mechanics-Samsung-Electro-Mechanics-CL05A475MP5NRNC_C23733.html; ComponentLink4Description: Samsung Component Library; ComponentLink4URL: https://weblib.samsungsem.com/mlcc/mlcc-ec.do?partNumber=CL05A475MP5NRN; Impedance (10V Bias) @ 2GHz: 1.52Ω
C6 C7 = CL05B104KO5NNNC: Capacitor, Ceramic (MLCC), 100nF, ±10%, 16V, X7R, ±10%, SMD 0402; Manufacturer: Samsung Electro-Mechanics; Temperature Rating: -55°C ~ 125°C; Capacitance @ 1V DC Bias: 104.721nF; Capacitance @ 1.2V DC Bias: 104.598nF; Capacitance @ 1.35V DC Bias: 104.495nF; Capacitance @ 1.5V DC Bias: 104.372nF; Capacitance @ 1.8V DC Bias: 104.042nF; Capacitance @ 2.5V DC Bias: 102.634nF; Capacitance @ 3.3V DC Bias: 100.452nF; Capacitance @ 3.7V DC Bias: 99.160nF; Capacitance @ 4.2V DC Bias: 97.441nF; Capacitance @ 5V DC Bias: 94.577nF; Capacitance @ 9V DC Bias: 78.638nF; Capacitance @ 12V DC Bias: 66.291nF; Capacitance @ 15V DC Bias: 54.779nF; Impedance (0V Bias) @ 100Hz: 1.71E+04Ω; Impedance (0V Bias) @ 500Hz: 3.48E+03Ω; Impedance (0V Bias) @ 1kHz: 1.75E+03Ω; Impedance (0V Bias) @ 5kHz: 356Ω; Impedance (0V Bias) @ 10kHz: 179Ω; Impedance (0V Bias) @ 50kHz: 36.4Ω; Impedance (0V Bias) @ 100kHz: 18.3Ω; Impedance (0V Bias) @ 500kHz: 3.72Ω; Impedance (0V Bias) @ 1MHz: 1.87Ω; Impedance (0V Bias) @ 5MHz: 0.373Ω; Impedance (0V Bias) @ 10MHz: 0.175Ω; Impedance (0V Bias) @ 50MHz: 0.064Ω; Impedance (0V Bias) @ 100MHz: 0.122Ω; Impedance (0V Bias) @ 500MHz: 0.525Ω; Impedance (0V Bias) @ 1GHz: 0.97Ω; Impedance (0V Bias) @ 2GHz: 2.26Ω; Impedance (0V Bias) @ 5GHz: 4.75Ω; Impedance (16V Bias) @ 100Hz: 2.55E+04Ω; Impedance (16V Bias) @ 500Hz: 5.18E+03Ω; Impedance (16V Bias) @ 1kHz: 2.61E+03Ω; Impedance (16V Bias) @ 5kHz: 529Ω; Impedance (16V Bias) @ 10kHz: 266Ω; Impedance (16V Bias) @ 50kHz: 54Ω; Impedance (16V Bias) @ 100kHz: 27.2Ω; Impedance (16V Bias) @ 500kHz: 5.5Ω; Impedance (16V Bias) @ 1MHz: 2.76Ω; Impedance (16V Bias) @ 5MHz: 0.587Ω; Impedance (16V Bias) @ 10MHz: 0.277Ω; Impedance (16V Bias) @ 50MHz: 0.0412Ω; Impedance (16V Bias) @ 100MHz: 0.133Ω; Impedance (16V Bias) @ 500MHz: 0.524Ω; Impedance (16V Bias) @ 1GHz: 0.969Ω; Impedance (16V Bias) @ 2GHz: 2.25Ω; Impedance (16V Bias) @ 5GHz: 4.7Ω; Package Size: 0402; JLCPCB Basic Part: Yes; JLCPCB Part Number: C1525; Supplier 1: LCSC; Category: Capacitors - MLCC; Supplier Part Number 1: C1525; Manufacturer Part Number: CL05B104KO5NNNC; Tolerance: ±10%; Voltage Rating: 16V; Temperature Coefficient: X7R; RoHS: Yes; ComponentLink1Description: Datasheet; ComponentLink1URL: https://wmsc.lcsc.com/wmsc/upload/file/pdf/v2/lcsc/2304140030_Samsung-Electro-Mechanics-CL05B104KO5NNNC_C1525.pdf; ComponentLink2Description: JLCPCB Part URL; ComponentLink2URL: https://jlcpcb.com/partdetail/C1525; ComponentLink3Description: LCSC Part URL; ComponentLink3URL: https://lcsc.com/product-detail/Multilayer-Ceramic-Capacitors-MLCC---SMD-SMT_Samsung-Electro-Mechanics-Samsung-Electro-Mechanics-CL05B104KO5NNNC_C1525.html; ComponentLink4Description: Samsung Component Library; ComponentLink4URL: https://weblib.samsungsem.com/mlcc/mlcc-ec.do?partNumber=CL05B104KO5NNN
D_LED1 D_LED2 = CMP-44529-000070-1: LED RED CLEAR SMD; Forward Voltage: 2V; Test Current: 20mA; Luminous Intensity: 15mcd; Viewing Angle: 120°; Wavelength: 627nm; Dominant Wavelength: 625nm; Lead Free: Lead Free; Length: 2mm; Forward Current: 20mA; Mount: Surface Mount; Packaging: Tape and Reel; Illumination Color: Red; Color: Red; Height: 1.1mm; Case Code (Metric): 2012; Case Code (Imperial): 0805; Case/Package: 0805; Width: 1.25mm; RoHS Compliant: Yes; Package Quantity: 2000; Min Operating Temperature: -40°C; Max Operating Temperature: 85°C; Lens Style: Clear
H_OLED1 H_SD1 = 4-pin Header: 4-pin Header 0.1mm pitch
R4-R11 R14 = 0402WGF1002TCE: Resistor, 10kΩ, ±1%, 62.5mW, 50V, ±100ppm/℃, -55℃~+155℃, SMD 0402; Manufacturer: Uniroyal; Supplier 1: LCSC; Manufacturer Part Number: 0402WGF1002TCE; Supplier Part Number 1: C25744; JLCPCB Part Number: C25744; Power Rating: 62.5mW; Category: Resistors; Package Size: 0402; JLCPCB Basic Part: Yes; Tolerance: ±1%; Voltage Rating: 50V; Temperature Coefficient: ±100ppm/℃; Temperature Rating: -55℃~+155℃; ComponentLink1Description: Datasheet; ComponentLink1URL: https://wmsc.lcsc.com/wmsc/upload/file/pdf/v2/lcsc/2206010100_UNI-ROYAL-Uniroyal-Elec-0402WGF1002TCE_C25744.pdf; ComponentLink2Description: JLCPCB Part URL; ComponentLink2URL: https://jlcpcb.com/partdetail/C25744
R12 R13 = 0402WGF220JTCE: Resistor, 22Ω, ±1%, 62.5mW, 50V, ±200ppm/℃, -55℃~+155℃, SMD 0402; Manufacturer: Uniroyal; Supplier 1: LCSC; Manufacturer Part Number: 0402WGF220JTCE; Supplier Part Number 1: C25092; JLCPCB Part Number: C25092; Power Rating: 62.5mW; Category: Resistors; Package Size: 0402; JLCPCB Basic Part: Yes; Tolerance: ±1%; Voltage Rating: 50V; Temperature Coefficient: ±200ppm/℃; Temperature Rating: -55℃~+155℃; ComponentLink1Description: Datasheet; ComponentLink1URL: https://wmsc.lcsc.com/wmsc/upload/file/pdf/v2/lcsc/2205311900_UNI-ROYAL-Uniroyal-Elec-0402WGF220JTCE_C25092.pdf; ComponentLink2Description: JLCPCB Part URL; ComponentLink2URL: https://jlcpcb.com/partdetail/C25092
R15 R16 = 0402WGF1000TCE: Resistor, 100Ω, ±1%, 62.5mW, 50V, ±200ppm/℃, -55℃~+155℃, SMD 0402; Manufacturer: Uniroyal; Supplier 1: LCSC; Manufacturer Part Number: 0402WGF1000TCE; Supplier Part Number 1: C25076; JLCPCB Part Number: C25076; Power Rating: 62.5mW; Category: Resistors; Package Size: 0402; JLCPCB Basic Part: Yes; Tolerance: ±1%; Voltage Rating: 50V; Temperature Coefficient: ±200ppm/℃; Temperature Rating: -55℃~+155℃; ComponentLink1Description: Datasheet; ComponentLink1URL: https://wmsc.lcsc.com/wmsc/upload/file/pdf/v2/lcsc/2205311900_UNI-ROYAL-Uniroyal-Elec-0402WGF1000TCE_C25076.pdf; ComponentLink2Description: JLCPCB Part URL; ComponentLink2URL: https://jlcpcb.com/partdetail/C25076
U1 = STM32L412KBT6: No Description Available; Mfr_Name: STMicroelectronics; RefDes: RefDes; Type: Type
X1 = SX3M32.768KM20F30TNN: Manufacturer: SCTF(星通时频); Add into BOM: yes; Normal temperature Frequency Tolerance: ±20ppm; Output Type: CMOS; Voltage - Supply: 1.62V~3.63V; Current - Supply: 90uA; Frequency Stability: ±30ppm; Symbol: SX3M32.768KM20F30TNN; Device: SX3M32.768KM20F30TNN; LCSC Part Name: 32.768kHz ±20ppm 1.62V~3.63V CMOS; Supplier Part: C2901582; Manufacturer Part: SX3M32.768KM20F30TNN; Supplier Footprint: SMD3225-4P; JLCPCB Part Class: Extended Part; Datasheet: https://atta.szlcsc.com/upload/public/pdf/source/20240605/38A6F081BC26201D4BADAAB4D2EED01C.pdf; Supplier: LCSC; Convert to PCB: yes; Value: 32.768kHz; Operating Temperature: -40℃~+85℃

## Sheet Display.SchDoc
size A; SheetNumber: 5; SheetTotal: 8
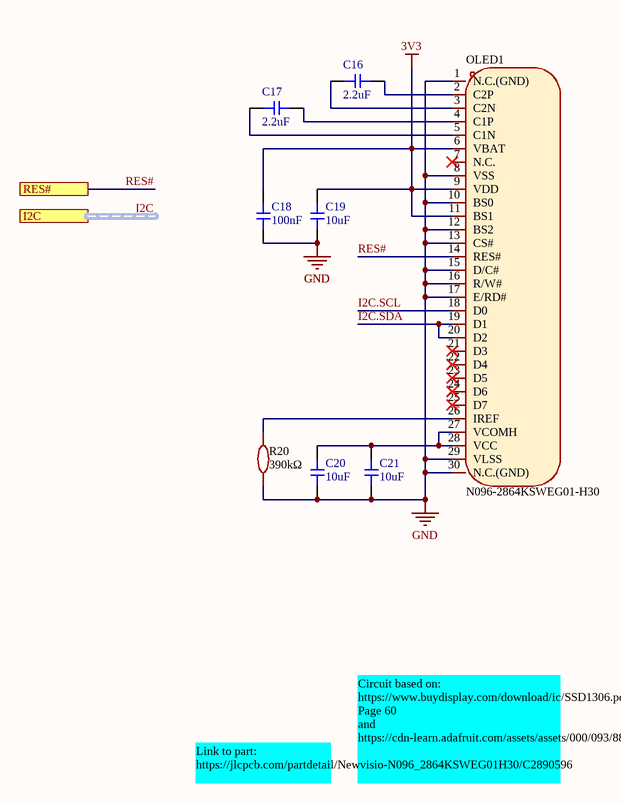
[diagram p3: Display.SchDoc]

### Parts
C16  Capacitance: 2.2uF  [CAP-0402]  (hidden comment: CL05A225MQ5NSNC)
C17  Capacitance: 2.2uF  [CAP-0402]  (hidden comment: CL05A225MQ5NSNC)
C18  Capacitance: 100nF  [CAP-0402]  (hidden comment: CL05B104KO5NNNC)
C19  Capacitance: 10uF  [CAP-0402]  (hidden comment: CL05A106MQ5NUNC)
C20  Capacitance: 10uF  [CAP-0402]  (hidden comment: CL05A106MQ5NUNC)
C21  Capacitance: 10uF  [CAP-0402]  (hidden comment: CL05A106MQ5NUNC)
OLED1  N096-2864KSWEG01-H30  [OLED_0.96-30P-P0.70-12864]
R20  390kΩ  [R0402]

### Ports
I2C (harness I2C, see STM32[1D]), RES# (see STM32[1D])

### Nets
3V3: C18.2 C19.2 OLED1.6(VBAT) OLED1.9(VDD) OLED1.11(BS1)
GND: C18.1 C19.1 C20.1 C21.1 OLED1.1(N.C.(GND)) OLED1.8(VSS) OLED1.10(BS0) OLED1.12(BS2) OLED1.13(CS#) OLED1.15(D/C#) OLED1.16(R/W#) OLED1.17(E/RD#) OLED1.29(VLSS) OLED1.30(N.C.(GND)) R20.1
I2C.SCL: OLED1.18(D0)
I2C.SDA: OLED1.19(D1) OLED1.20(D2)
RES#: OLED1.14(RES#) ; port RES#  [project net OLED_NRST]
NetC16_1: C16.1 OLED1.3(C2N)
NetC16_2: C16.2 OLED1.2(C2P)
NetC17_1: C17.1 OLED1.5(C1N)
NetC17_2: C17.2 OLED1.4(C1P)
NetC20_2: C20.2 C21.2 OLED1.27(VCOMH) OLED1.28(VCC)
NetOLED1_26: OLED1.26(IREF) R20.2

Not connected (* = marked no-connect by the designer): OLED1 7(N.C.)* 21(D3)* 22(D4)* 23(D5)* 24(D6)* 25(D7)*

### Buses and harness runs
harness I2C = port I2C

### Notes on the sheet
- Link to part:
  https://jlcpcb.com/partdetail/Newvisio-N096_2864KSWEG01H30/C2890596
- Circuit based on:
  https://www.buydisplay.com/download/ic/SSD1306.pdf
  Page 60
  and
  https://cdn-learn.adafruit.com/assets/assets/000/093/884/original/adafruit_products_0-96in_OLED_sch.png?1596746114

### Library data of the parts
C16 C17 = CL05A225MQ5NSNC: Capacitor, Ceramic (MLCC), 2.2uF, ±20%, 6.3V, X5R, ±20%, SMD 0402; Manufacturer: Samsung Electro-Mechanics; Temperature Rating: -55°C ~ 85°C; Capacitance @ 1V DC Bias: 2.019uF; Capacitance @ 1.2V DC Bias: 1.921uF; Capacitance @ 1.35V DC Bias: 1.843uF; Capacitance @ 1.5V DC Bias: 1.764uF; Capacitance @ 1.8V DC Bias: 1.611uF; Capacitance @ 2.5V DC Bias: 1.302uF; Capacitance @ 3.3V DC Bias: 1.004uF; Capacitance @ 3.7V DC Bias: 0.893uF; Capacitance @ 4.2V DC Bias: 0.780uF; Capacitance @ 5V DC Bias: 0.638uF; Impedance (0V Bias) @ 100Hz: 935Ω; Impedance (0V Bias) @ 500Hz: 192Ω; Impedance (0V Bias) @ 1kHz: 97.4Ω; Impedance (0V Bias) @ 5kHz: 20Ω; Impedance (0V Bias) @ 10kHz: 10.1Ω; Impedance (0V Bias) @ 50kHz: 2.08Ω; Impedance (0V Bias) @ 100kHz: 1.05Ω; Impedance (0V Bias) @ 500kHz: 0.214Ω; Impedance (0V Bias) @ 1MHz: 0.107Ω; Impedance (0V Bias) @ 5MHz: 0.0123Ω; Impedance (0V Bias) @ 10MHz: 0.0171Ω; Impedance (0V Bias) @ 50MHz: 0.0697Ω; Impedance (0V Bias) @ 100MHz: 0.123Ω; Impedance (0V Bias) @ 500MHz: 0.484Ω; Impedance (0V Bias) @ 1GHz: 0.858Ω; Impedance (0V Bias) @ 2GHz: 1.87Ω; Impedance (0V Bias) @ 5GHz: 3.69Ω; Package Size: 0402; JLCPCB Basic Part: Yes; JLCPCB Part Number: C12530; Supplier 1: LCSC; Category: Capacitors - MLCC; Supplier Part Number 1: C12530; Manufacturer Part Number: CL05A225MQ5NSNC; Tolerance: ±20%; Voltage Rating: 6.3V; Temperature Coefficient: X5R; RoHS: Yes; ComponentLink1Description: Datasheet; ComponentLink1URL: https://wmsc.lcsc.com/wmsc/upload/file/pdf/v2/lcsc/2304140030_Samsung-Electro-Mechanics-CL05A225MQ5NSNC_C12530.pdf; ComponentLink2Description: JLCPCB Part URL; ComponentLink2URL: https://jlcpcb.com/partdetail/C12530; ComponentLink3Description: LCSC Part URL; ComponentLink3URL: https://lcsc.com/product-detail/Multilayer-Ceramic-Capacitors-MLCC---SMD-SMT_Samsung-Electro-Mechanics-Samsung-Electro-Mechanics-CL05A225MQ5NSNC_C12530.html; ComponentLink4Description: Samsung Component Library; ComponentLink4URL: https://weblib.samsungsem.com/mlcc/mlcc-ec.do?partNumber=CL05A225MQ5NSN
C18 = CL05B104KO5NNNC: as C6 on sheet STM32; Package Size: 0402; JLCPCB Basic Part: Yes; JLCPCB Part Number: C1525; Supplier 1: LCSC; Category: Capacitors - MLCC; Supplier Part Number 1: C1525; Manufacturer Part Number: CL05B104KO5NNNC; Tolerance: ±10%; Voltage Rating: 16V; Temperature Coefficient: X7R; RoHS: Yes; ComponentLink1Description: Datasheet; ComponentLink1URL: https://wmsc.lcsc.com/wmsc/upload/file/pdf/v2/lcsc/2304140030_Samsung-Electro-Mechanics-CL05B104KO5NNNC_C1525.pdf; ComponentLink2Description: JLCPCB Part URL; ComponentLink2URL: https://jlcpcb.com/partdetail/C1525; ComponentLink3Description: LCSC Part URL; ComponentLink3URL: https://lcsc.com/product-detail/Multilayer-Ceramic-Capacitors-MLCC---SMD-SMT_Samsung-Electro-Mechanics-Samsung-Electro-Mechanics-CL05B104KO5NNNC_C1525.html; ComponentLink4Description: Samsung Component Library; ComponentLink4URL: https://weblib.samsungsem.com/mlcc/mlcc-ec.do?partNumber=CL05B104KO5NNN
C19-C21 = CL05A106MQ5NUNC: Capacitor, Ceramic (MLCC), 10uF, ±20%, 6.3V, X5R, ±20%, SMD 0402; Manufacturer: Samsung Electro-Mechanics; Temperature Rating: -55°C ~ 85°C; Capacitance @ 1V DC Bias: 7.816uF; Capacitance @ 1.2V DC Bias: 7.392uF; Capacitance @ 1.35V DC Bias: 7.025uF; Capacitance @ 1.5V DC Bias: 6.639uF; Capacitance @ 1.8V DC Bias: 5.875uF; Capacitance @ 2.5V DC Bias: 4.552uF; Capacitance @ 3.3V DC Bias: 3.499uF; Capacitance @ 3.7V DC Bias: 3.122uF; Capacitance @ 4.2V DC Bias: 2.720uF; Capacitance @ 5V DC Bias: 2.236uF; Impedance (0V Bias) @ 100Hz: 243Ω; Impedance (0V Bias) @ 500Hz: 50Ω; Impedance (0V Bias) @ 1kHz: 25.3Ω; Impedance (0V Bias) @ 5kHz: 5.23Ω; Impedance (0V Bias) @ 10kHz: 2.64Ω; Impedance (0V Bias) @ 50kHz: 0.544Ω; Impedance (0V Bias) @ 100kHz: 0.275Ω; Impedance (0V Bias) @ 500kHz: 0.0554Ω; Impedance (0V Bias) @ 1MHz: 0.026Ω; Impedance (0V Bias) @ 5MHz: 0.012Ω; Impedance (0V Bias) @ 10MHz: 0.0181Ω; Impedance (0V Bias) @ 50MHz: 0.0531Ω; Impedance (0V Bias) @ 100MHz: 0.09Ω; Impedance (0V Bias) @ 500MHz: 0.323Ω; Impedance (0V Bias) @ 1GHz: 0.567Ω; Impedance (0V Bias) @ 2GHz: 1.33Ω; Impedance (0V Bias) @ 5GHz: 2.66Ω; Package Size: 0402; JLCPCB Basic Part: Yes; JLCPCB Part Number: C15525; Supplier 1: LCSC; Category: Capacitors - MLCC; Supplier Part Number 1: C15525; Manufacturer Part Number: CL05A106MQ5NUNC; Tolerance: ±20%; Voltage Rating: 6.3V; Temperature Coefficient: X5R; RoHS: Yes; ComponentLink1Description: Datasheet; ComponentLink1URL: https://wmsc.lcsc.com/wmsc/upload/file/pdf/v2/lcsc/2208231630_Samsung-Electro-Mechanics-CL05A106MQ5NUNC_C15525.pdf; ComponentLink2Description: JLCPCB Part URL; ComponentLink2URL: https://jlcpcb.com/partdetail/C15525; ComponentLink3Description: LCSC Part URL; ComponentLink3URL: https://lcsc.com/product-detail/Multilayer-Ceramic-Capacitors-MLCC---SMD-SMT_Samsung-Electro-Mechanics-Samsung-Electro-Mechanics-CL05A106MQ5NUNC_C15525.html; ComponentLink4Description: Samsung Component Library; ComponentLink4URL: https://weblib.samsungsem.com/mlcc/mlcc-ec.do?partNumber=CL05A106MQ5NUN
OLED1 = N096-2864KSWEG01-H30: Manufacturer: Newvision(新智景); Add into BOM: yes; Main Control Chip: SSD1306; Symbol: N096-2864KSWEG01-H30; Device: N096-2864KSWEG01-H30; LCSC Part Name: 0.96寸 白色 128x64像素分辨率 单色 30PIN; Supplier Part: C2890596; Manufacturer Part: N096-2864KSWEG01-H30; Supplier Footprint: -; JLCPCB Part Class: Extended Part; Supplier: LCSC; Convert to PCB: yes; Size: 0.96
R20 = 0402WGF3903TCE: 390k Resistor; Manufacturer: UNI-ROYAL(厚声); Add into BOM: yes; Tolerance: ±1%; Temperature Coefficient: ±100ppm/℃; Symbol: 0402WGF3903TCE; Device: 0402WGF3903TCE; LCSC Part Name: 390kΩ ±1% 62.5mW 厚膜电阻; Supplier Part: C25782; Manufacturer Part: 0402WGF3903TCE; Supplier Footprint: 0402; JLCPCB Part Class: Extended Part; Datasheet: https://atta.szlcsc.com/upload/public/pdf/source/20200306/C422600_1E6D84923E4A46A82E41ADD87F860B5C.pdf; Supplier: LCSC; Convert to PCB: yes; Type: Thick Film Resistors; Operating Temperature Range: -55℃~+155℃; Value: 390kΩ

## Sheet MicroSD.SchDoc
size A; SheetNumber: 4; SheetTotal: 8
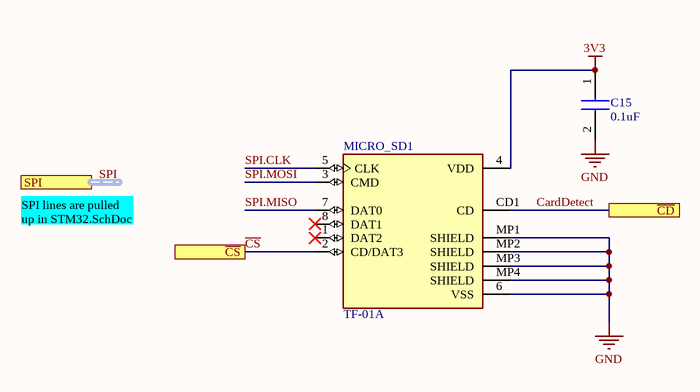
[diagram p4: MicroSD.SchDoc]

### Parts
C15  value 0.1uF  [CAPC1005X55N]  (hidden comment: 0.1uF Ceramic Capacitor)
MICRO_SD1  TF-01A  [TF-01A]

### Ports
SPI (harness SPI, see STM32[1D]), ~{CD} (see STM32[1D]), ~{CS} (see STM32[1D])

### Nets
3V3: C15.1 MICRO_SD1.4(VDD)
GND: C15.2 MICRO_SD1.6(VSS) MICRO_SD1.MP1(SHIELD) MICRO_SD1.MP2(SHIELD) MICRO_SD1.MP3(SHIELD) MICRO_SD1.MP4(SHIELD)
~{CS}: MICRO_SD1.2(CD/DAT3) ; port ~{CS}
CardDetect: MICRO_SD1.CD1(CD) ; port ~{CD}
SPI.CLK: MICRO_SD1.5(CLK)
SPI.MISO: MICRO_SD1.7(DAT0)
SPI.MOSI: MICRO_SD1.3(CMD)

Not connected (* = marked no-connect by the designer): MICRO_SD1 1(DAT2)* 8(DAT1)*

### Buses and harness runs
harness SPI = port SPI

### Notes on the sheet
- SPI lines are pulled up in STM32.SchDoc

### Library data of the parts
C15 = CL05B104KO5NNNC: Manufacturer_Name: SAMSUNG; Datasheet Link: https://datasheet.datasheetarchive.com/originals/distributors/Datasheets-DGA10/2408147.pdf; Height: 0.55mm; Manufacturer_Part_Number: CL05B104KO5NNNC; Mouser Part Number: 187-CL05B104KO5NNNC; Mouser Price/Stock: https://www.mouser.co.uk/ProductDetail/Samsung-Electro-Mechanics/CL05B104KO5NNNC?qs=hqM3L16%252BxlfT2SKOuAUq6Q%3D%3D; Arrow Part Number: CL05B104KO5NNNC; Arrow Price/Stock: https://www.arrow.com/en/products/cl05b104ko5nnnc/samsung-electro-mechanics?utm_currency=USD&region=europe
MICRO_SD1 = TF-01A: Standard Card Edge Connectors; MF: HRO Electronics Co., Ltd.; Price: None; Availability: Not in stock; MP: TF-01A; Package: Package; SnapEDA_Link: https://www.snapeda.com/parts/TF-01A/HRO+Electronics+Co.%252C+Ltd./view-part/?ref=snap; Check_prices: https://www.snapeda.com/parts/TF-01A/HRO+Electronics+Co.%252C+Ltd./view-part/?ref=eda; Value: *

## Sheet SWD.SchDoc
size A; SheetNumber: 6; SheetTotal: 8
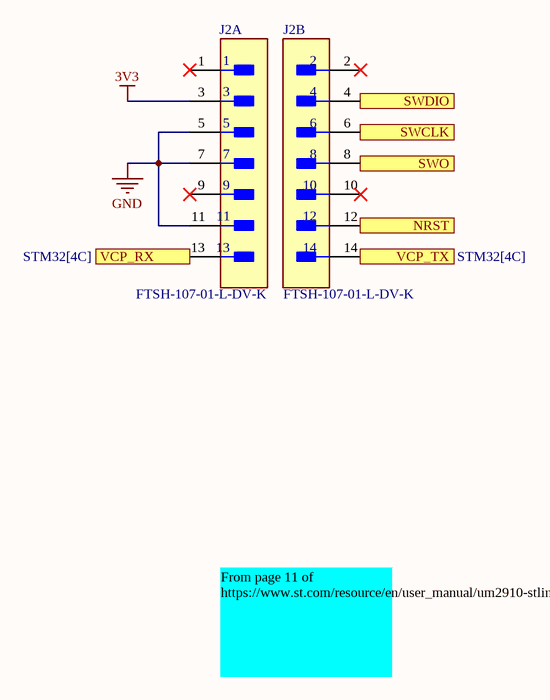
[diagram p5: SWD.SchDoc]

### Parts
J2  FTSH-107-01-L-DV-K  [FP-FTSH-107-01-L-DV-K-MFG]  (parts A,B of 2)

### Ports
NRST (see STM32[4C]), SWCLK (see STM32[4C]), SWDIO (see STM32[4C]), SWO (see STM32[4C]), VCP_RX (see STM32[4C]), VCP_TX (see STM32[4C])

### Nets
3V3: J2.3
GND: J2.5 J2.7 J2.11
MCU_VCP_RX: J2.14 ; port VCP_TX
MCU_VCP_TX: J2.13 ; port VCP_RX
NRST: J2.12 ; port NRST
SWCLK: J2.6 ; port SWCLK
SWDIO: J2.4 ; port SWDIO
SWO: J2.8 ; port SWO

Not connected (* = marked no-connect by the designer): J2 1* 2* 9* 10*

### Notes on the sheet
- From page 11 of
  https://www.st.com/resource/en/user_manual/um2910-stlinkv3minie-debuggerprogrammer-tiny-probe-for-stm32-microcontrollers-stmicroelectronics.pdf

### Library data of the parts
J2 = CMP-02766-001412-1: CONN HEADER SMD 14POS 1.27MM; Number of Contacts: 14; Gender: Male; Termination: Solder; Lead Free: Lead Free; Depth: 5.84mm; Min Operating Temperature: -55°C; Length: 8.89mm; RoHS Compliant: Yes; Housing Material: Polymer; Housing Color: Black; Max Operating Temperature: 125°C; Number of Rows: 2; Pitch: 1.27mm; Radiation Hardening: No; Orientation: Straight; Packaging: Rail/Tube; Contact Material: Bronze; Contact Plating: Gold

## Sheet Fuse.SchDoc
size A; SheetNumber: 2; SheetTotal: 8
Used 2 times, as channels F1, F2. Parts and nets are listed once, with the designators drawn on the sheet.
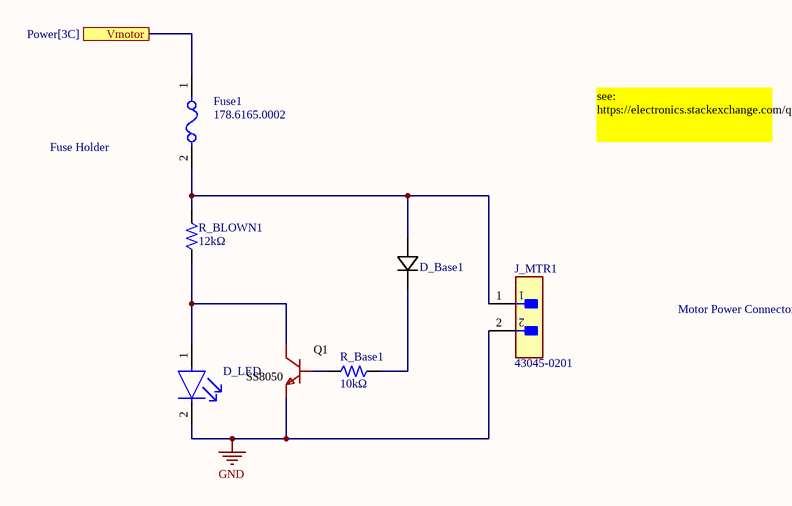
[diagram p6: Fuse.SchDoc]

### Parts
D_Base1  Diode  [M7_MDD]  (value not drawn)
D_LED  (no value)  [FP-AP2012EC-MFG]
Fuse1  178.6165.0002  [FP-178_6165-MFG]
J_MTR1  43045-0201  [FP-43045-0201-MFG]
Q1  SS8050  [SOT-23-3_L2.9-W1.3-P1.90-LS2.4-BR]
R_Base1  Resistance: 10kΩ  [RES-0603]  (hidden comment: 0603WAF1002T5E)
R_BLOWN1  Resistance: 12kΩ  [RES-0402]  (hidden comment: 0402WGF1202TCE)

### Ports
Vmotor (see Power[3C])

### Nets
GND: D_LED.2(C) J_MTR1.2 Q1.2(E)
Vmotor: Fuse1.1 ; port Vmotor
NetD_Base1_1: D_Base1.1(CATHODE) R_Base1.2
NetD_Base1_2: D_Base1.2(ANODE) Fuse1.2 J_MTR1.1 R_BLOWN1.2
NetD_LED_1: D_LED.1(A) Q1.3(C) R_BLOWN1.1
NetQ1_1: Q1.1(B) R_Base1.1

### Channels
F1: designators end in A; ports Vmotor=Vmotor1
F2: designators end in B; ports Vmotor=Vmotor2

### Notes on the sheet
- (near Fuse1) Fuse Holder
- see: https://electronics.stackexchange.com/questions/148818/fuse-blown-indicator-circuits-compilation
- (near J_MTR1) Motor Power Connector

### Library data of the parts
D_Base1 = M7: 1A Independent Type 1kV 1.1V@1A SMA(DO-214AC) Diodes - General Purpose ROHS; Mfr_Name: Microdiode Electronics
D_LED = CMP-44529-000070-1: as D_LED1 on sheet STM32; Lead Free: Lead Free; Length: 2mm; Forward Current: 20mA; Mount: Surface Mount; Packaging: Tape and Reel; Illumination Color: Red; Color: Red; Height: 1.1mm; Case Code (Metric): 2012; Case Code (Imperial): 0805; Case/Package: 0805; Width: 1.25mm; RoHS Compliant: Yes; Package Quantity: 2000; Min Operating Temperature: -40°C; Max Operating Temperature: 85°C; Lens Style: Clear
Fuse1 = CMP-08604-000022-1: FUSE HOLDER BLADE 80V PCB; Manufacturer: Littelfuse; Standoff Height: 1mm; Number Of Fuses: 1; Conn Orientation: Vertical; Device Class L1: Circuit Protection; Height: 17.5mm; Mouser Description: Fuse Holder FLR (ATO) PCB 4-pin Holder; Device Class L3: unset; Lead Free: Yes; Digikey Description: FUSE HOLDER BLADE 80V PCB; Voltage Rating Ac: 80V; ComponentLink2Description: Datasheet; Manufacturer Part Number: 178.6165.0002; Voltage Rating Dc: 80V; Automotive: No; Octopart: https://octopart.com/178.6165.0002-littelfuse-13138759; Device Class L2: Fuse Holders; Package: 178.6165; RoHS: TRUE; ComponentLink2URL: https://www.littelfuse.com/~/media/commercial-vehicle/datasheets/automotive-fuse-holders/ato/littelfuse-fuse-holder-ato-flr-pcb-datasheet.pdf; Category: Fuse
J_MTR1 = CMP-04776-000998-1: as J1 on sheet Power; Number of Positions: 2; Halogen Free: Low Halogen; Series: 43045; Mount: Through Hole; Packaging: Tray; Row Spacing: 3mm; Contact Material: Brass; Radiation Hardening: No; Number of Contacts: 2; Orientation: Right Angle; Max Operating Temperature: 105°C; Housing Material: Thermoplastic; Contact Plating: Gold; Case/Package: 0201; Number of Rows: 2; Min Operating Temperature: -40°C; Termination: Solder; Package Quantity: 3168
Q1 = SS8050(RANGE:200-350)_C2150: BJT NPN; Manufacturer: CJ(江苏长电/长晶); Symbol: SS8050_C2150; Add into BOM: yes; DC Current Gain (hFE@Ic,Vce): 200@800mA,1V; Transition Frequency (fT): 100MHz; Collector Cut-Off Current (Icbo): 100nA; Collector-Emitter Saturation Voltage (VCE(sat)@Ic,Ib): 500mV@800mA,80mA; Device: SS8050(RANGE:200-350)_C2150; LCSC Part Name: NPN 电流:1.5A 耐压:25V hfe=200~350; Supplier Part: C2150; Manufacturer Part: SS8050(RANGE:200-350); Supplier Footprint: SOT-23; JLCPCB Part Class: Basic Part; Datasheet: https://atta.szlcsc.com/upload/public/pdf/source/20230322/AEE86F4B043774EFF80CAEA14A37D9E9.pdf; Supplier: LCSC; Convert to PCB: yes; Operating Temperature: -55℃~+150℃
R_Base1 = 0603WAF1002T5E: Resistor, 10kΩ, ±1%, 100mW, 75V, ±100ppm/℃, -55℃~+155℃, SMD 0603; Manufacturer: Uniroyal; Supplier 1: LCSC; Manufacturer Part Number: 0603WAF1002T5E; Supplier Part Number 1: C25804; JLCPCB Part Number: C25804; Power Rating: 100mW; Category: Resistors; Package Size: 0603; JLCPCB Basic Part: Yes; Tolerance: ±1%; Voltage Rating: 75V; Temperature Coefficient: ±100ppm/℃; Temperature Rating: -55℃~+155℃; ComponentLink1Description: Datasheet; ComponentLink1URL: https://wmsc.lcsc.com/wmsc/upload/file/pdf/v2/lcsc/2206010045_UNI-ROYAL-Uniroyal-Elec-0603WAF1002T5E_C25804.pdf; ComponentLink2Description: JLCPCB Part URL; ComponentLink2URL: https://jlcpcb.com/partdetail/C25804
R_BLOWN1 = 0402WGF1202TCE: Resistor, 12kΩ, ±1%, 62.5mW, 50V, ±100ppm/℃, -55℃~+155℃, SMD 0402; Manufacturer: Uniroyal; Supplier 1: LCSC; Manufacturer Part Number: 0402WGF1202TCE; Supplier Part Number 1: C25752; JLCPCB Part Number: C25752; Power Rating: 62.5mW; Category: Resistors; Package Size: 0402; JLCPCB Basic Part: Yes; Tolerance: ±1%; Voltage Rating: 50V; Temperature Coefficient: ±100ppm/℃; Temperature Rating: -55℃~+155℃; ComponentLink1Description: Datasheet; ComponentLink1URL: https://wmsc.lcsc.com/wmsc/upload/file/pdf/v2/lcsc/2206010100_UNI-ROYAL-Uniroyal-Elec-0402WGF1202TCE_C25752.pdf; ComponentLink2Description: JLCPCB Part URL; ComponentLink2URL: https://jlcpcb.com/partdetail/C25752